# Altium schematic sheet Current_detector.SchDoc
size A4; SheetNumber: 6; SheetTotal: 7
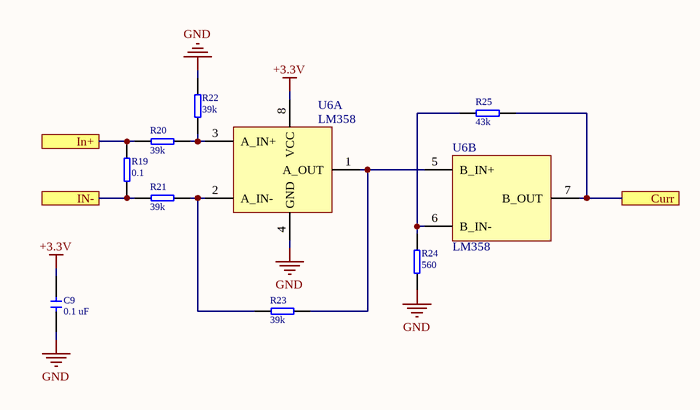
[diagram p0: Current_detector.SchDoc]

## Parts
C9  value 0.1 uF  [CERCAP 0402]
R19  value 0.1  [RES 1206]
R20  value 39k  [RES 0402]
R21  value 39k  [RES 0402]
R22  value 39k  [RES 0402]
R23  value 39k  [RES 0402]
R24  value 560  [RES 0402]
R25  value 43k  [RES 0402]
U6  LM358  [SO-8]  (parts A,B of 2)

## Ports
Curr, In+, IN-

## Nets
+3.3V: C9.2 U6.8(VCC)
GND: C9.1 R22.2 R24.1 U6.4(GND)
Curr: R25.2 U6.7(B_OUT) ; port Curr
In+: R19.2 R20.1 ; port In+
IN-: R19.1 R21.1 ; port IN-
NetR20_2: R20.2 R22.1 U6.3(A_IN+)
NetR21_2: R21.2 R23.1 U6.2(A_IN-)
NetR23_2: R23.2 U6.1(A_OUT) U6.5(B_IN+)
NetR24_2: R24.2 R25.1 U6.6(B_IN-)

## Library data of the parts
C9 = !Capacitor: Capacitor; IsSMT: NoSMT; Diel: X7R; Voltage: *
R19-R25 = !Resistor: Resistor; IsSMT: NoSMT
U6 = DualOpAmp: Operational amplifier